# Altium project UVSD_HABalloon_OBC.PrjPcb
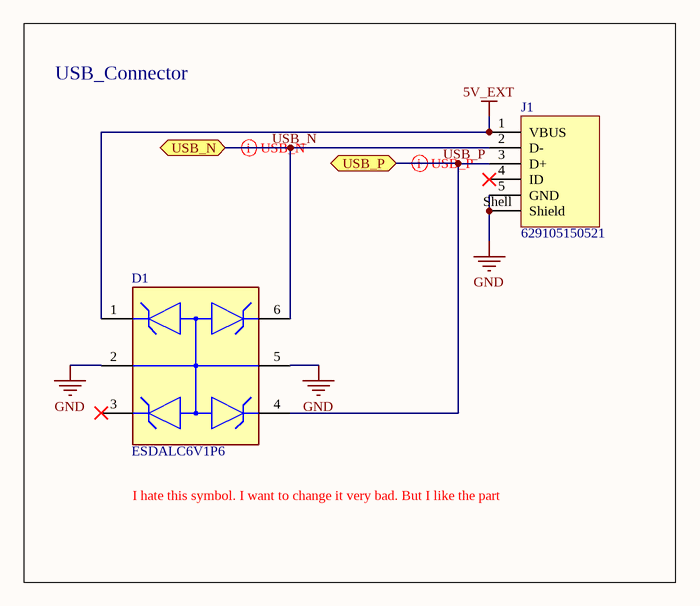
[diagram p0: IO.SchDoc]
3 sheets, 22 parts. Net scope: flat (ports and power ports of the same name join across sheets).
Sheets:
  Main.SchDoc
  IO.SchDoc
  Power.SchDoc

## Sheet Main.SchDoc
size A4; SheetNumber: 1; SheetTotal: 1

## Sheet IO.SchDoc: Input/Output
size A3; DrawnBy: Evan Peters; Revision: 1; SheetNumber: 3; SheetTotal: 4

### Parts
D1  ESDALC6V1P6  [FP-SOT-666IP-MFG]
J1  629105150521  [629105150521]

### Blocks framed on the sheet
USB_Connector: D1 J1

### Ports
USB_N (bidir, see Main[5B], MCU_STM32[2C]), USB_P (bidir, see Main[5B], MCU_STM32[2C])

### Nets
5V_EXT: D1.1 J1.1(VBUS)
GND: D1.2 D1.5 J1.5(GND) J1.Shell(Shield)
USB_N: D1.6 J1.2(D-) ; port USB_N
USB_P: D1.4 J1.3(D+) ; port USB_P

Not connected (* = marked no-connect by the designer): D1 3*; J1 4(ID)*

### Layout directives
differential pair: USB_N, USB_P

### Notes on the sheet
- I hate this symbol. I want to change it very bad. But I like the part

### Library data of the parts
D1 = CMP-12225-000016-1: TVS DIODE 3V SOT666IP; Manufacturer: STMicroelectronics; Peak Pulse Power: 30W; Capacitance: 7.5pF; Value: 7.5pF; Number Of Channels: 4; Description: 4 Channel 6.1V Uni-Directional Transil ESD Protection - SOT-666IP; Max Junction Temp: +150°C; Breakdown Voltage: 6.1V; Direction: Unidirectional; Device Class L1: Circuit Protection; Reverse Standoff Voltage: 3V; Package: SOT-666IP; Device Class L3: unset; Temperature Range Low: -40°C; ComponentLink2Description: Datasheet; Height: 0.62mm; ComponentLink2URL: https://www.st.com/resource/en/datasheet/esdalc6v1px.pdf; Category: Diode; RoHS: TRUE; Device Class L2: TVS Diodes; Mouser Description: ESDALC Series 4 Channel 6.1V Uni-Directional Transil? ESD Protection - SOT-666IP; Lead Free: Yes; Manufacturer Part Number: ESDALC6V1P6; Temperature Range High: +150°C; Temperature: -40°C to +150°C; Digikey Description: TVS DIODE 3V SOT666IP; Automotive: No; Octopart: https://octopart.com/esdalc6v1p6-stmicroelectronics-347727
J1 = CMP-1502-03252-3: NexarPartId: 52645113; Number of Contacts: 5; Contact Resistance: 30mΩ; Connector Type: USB; Voltage Rating: 30V; Current Rating: 3A; USB Standard: USB 2.0; Gender: Receptacle; Insulation Resistance: 1GΩ; Height: 2.86mm; REACH SVHC: Unknown; RoHS: Compliant; Features: Shielded; Termination: SMD/SMT; Number of Pins: 5; Contact Plating: Gold; Packaging: Tape and Reel; Contact Material: Gold; Mount: Horizontal, Surface Mount; Max Operating Temperature: 85°C; Lead Free: Lead Free; Min Operating Temperature: -40°C; Orientation: Horizontal; Operating Supply Voltage: 30V

## Sheet Power.SchDoc: Power Control
size A3; DrawnBy: Evan Peters; Revision: 1; SheetNumber: 4; SheetTotal: 4
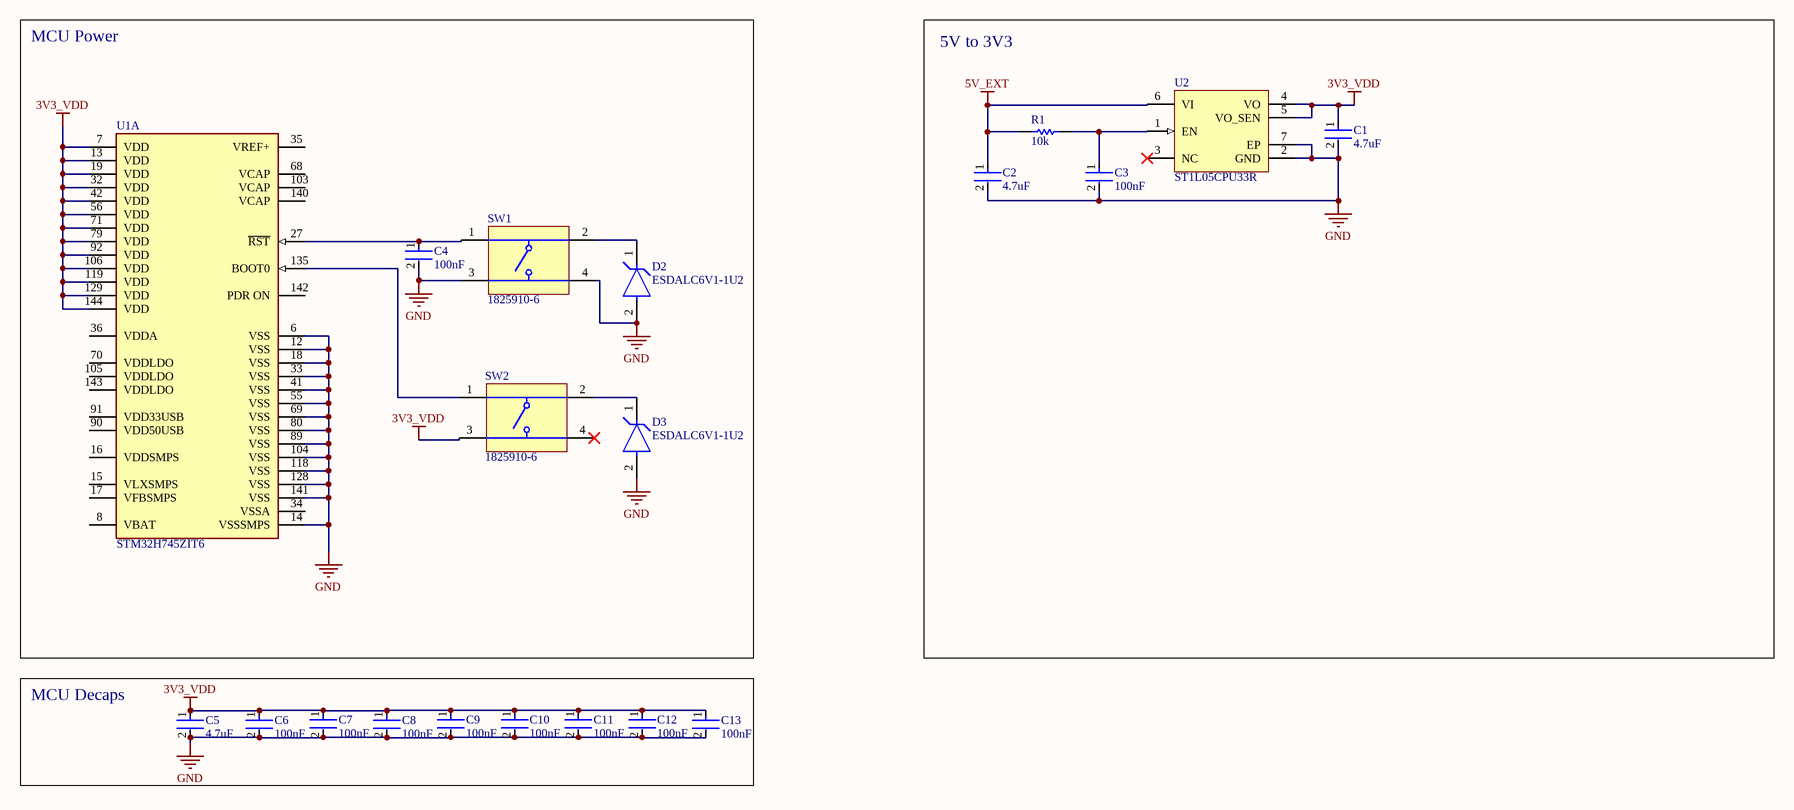
[diagram p1: Power.SchDoc]

### Parts
C1  4.7uF  [FP-C0603-CG-MFG]
C2  4.7uF  [FP-C0603-CG-MFG]
C3  100nF  [FP-CGA3E-0_3-0_1-IPC_A]
C4  100nF  [FP-CGA3E-0_3-0_1-IPC_A]
C5  4.7uF  [FP-C0603-CG-MFG]
C6  100nF  [FP-CGA3E-0_3-0_1-IPC_A]
C7  100nF  [FP-CGA3E-0_3-0_1-IPC_A]
C8  100nF  [FP-CGA3E-0_3-0_1-IPC_A]
C9  100nF  [FP-CGA3E-0_3-0_1-IPC_A]
C10  100nF  [FP-CGA3E-0_3-0_1-IPC_A]
C11  100nF  [FP-CGA3E-0_3-0_1-IPC_A]
C12  100nF  [FP-CGA3E-0_3-0_1-IPC_A]
C13  100nF  [FP-CGA3E-0_3-0_1-IPC_A]
D2  ESDALC6V1-1U2  [FP-ST0201-MFG]
D3  ESDALC6V1-1U2  [FP-ST0201-MFG]
R1  10k  [RESC1609X50X30NL8T20]
SW1  1825910-6  [TECO-1825910-6_V]
SW2  1825910-6  [TECO-1825910-6_V]
U1  STM32H745ZIT6  [FP-LQFP144-1A-MFG]  (part A of 3)
U2  ST1L05CPU33R  [DFN6D_N]

### Blocks framed on the sheet
MCU Power: C4 D2 D3 SW1 SW2 U1
5V to 3V3: C1-C3 R1 U2
MCU Decaps: C5-C13

### Nets
3V3_VDD: C1.1 C5.1 C6.1 C7.1 C8.1 C9.1 C10.1 C11.1 C12.1 C13.1 SW2.3 U1.7(VDD) U1.13(VDD) U1.19(VDD) U1.32(VDD) U1.42(VDD) U1.56(VDD) U1.71(VDD) U1.79(VDD) U1.92(VDD) U1.106(VDD) U1.119(VDD) U1.129(VDD) U1.144(VDD) U2.4(VO) U2.5(VO_SEN)
5V_EXT: C2.1 R1.1 U2.6(VI)
GND: C1.2 C2.2 C3.2 C4.2 C5.2 C6.2 C7.2 C8.2 C9.2 C10.2 C11.2 C12.2 C13.2 D2.2(A) D3.2(A) SW1.3 SW1.4 U1.6(VSS) U1.12(VSS) U1.14(VSSSMPS) U1.18(VSS) U1.33(VSS) U1.41(VSS) U1.55(VSS) U1.69(VSS) U1.80(VSS) U1.89(VSS) U1.104(VSS) U1.118(VSS) U1.128(VSS) U1.141(VSS) U2.2(GND) U2.7(EP)
NetC3_1: C3.1 R1.2 U2.1(EN)
NetC4_1: C4.1 SW1.1 U1.27(~{RST})
NetD2_1: D2.1(C) SW1.2
NetD3_1: D3.1(C) SW2.2
NetSW2_1: SW2.1 U1.135(BOOT0)

Not connected (* = marked no-connect by the designer): SW2 4*; U1 8(VBAT) 15(VLXSMPS) 16(VDDSMPS) 17(VFBSMPS) 34(VSSA) 35(VREF+) 36(VDDA) 68(VCAP) 70(VDDLDO) 90(VDD50USB) 91(VDD33USB) 103(VCAP) 105(VDDLDO) 140(VCAP) 142(PDR_ON) 143(VDDLDO); U2 3(NC)*

### Library data of the parts
C1 C2 C5 = CMP-2006-02256-2: CAP CER 4.7UF 6.3V X5R 0603; Manufacturer: Kemet; Manufacturer Part Number: C0603C475K9PACTU; Temperature Coefficient: 15%; Tolerance: 10%; Description: 4.7µF ±10% 6.3V Ceramic Capacitor X5R 0603 (1608 Metric); Material: Ceramic; Device Class L3: Ceramic Capacitors; RoHS: TRUE; Value: 4.7uF; Lead Free: Yes; ComponentLink2Description: Datasheet; Mouser Description: Multilayer Ceramic Capacitors MLCC - SMD/SMT 6.3volts 4.7uF X5R 10%; Package: C0603-CG; Digikey Description: CAP CER 4.7UF 6.3V X5R 0603; ComponentLink2URL: https://content.kemet.com/datasheets/KEM_C1006_X5R_SMD.pdf; Category: Cap; Temperature Range Low: -55°C; Capacitance: 4.7uF; Temperature: -55°C to +85°C; Octopart: https://octopart.com/c0603c475k9pactu-kemet-104242; Ipc Land Pattern Name: CAPC16080X80; Voltage Rating: 6.3V; Temperature Range High: +85°C; Height: 0.9mm; Temperature Characteristic: X5R; Device Class L1: Passive Components; Automotive: No; Device Class L2: Capacitors
C3 C4 C6-C13 = CMP-2000-07546-2: Cap Ceramic 100nF 50V X7R 10% Pad SMD 0603 +125°C Automotive T/R; Weight: 7.1E-05oz; Composition: Ceramic; Max Operating Temperature: 125°C; Termination: SMD/SMT; Dielectric: X7R; Length: 1.6mm; Package Quantity: 1; REACH SVHC: No SVHC; Lead Free: Lead Free; Case Code (Metric): 1608; Min Operating Temperature: -55°C; Packaging: Tape and Reel; Tolerance: 10%; Voltage Rating: 50V; Case Code (Imperial): 0603; Capacitance: 100nF; Case/Package: 0603; Voltage Rating (DC): 50V; Depth: 0.8mm; Radiation Hardening: No; Ratings: AEC-Q200; Mount: Surface Mount; Voltage: 50V; Thickness: 0.035inch; Width: 0.8mm; Height: 0.8mm
D2 D3 = CMP-12225-000007-1: TVS DIODE 3V ST0201; Manufacturer: STMicroelectronics; Number Of Channels: 1; Direction: Unidirectional; Max Junction Temp: +125°C; Breakdown Voltage: 6.1V; Capacitance: 12pF; Peak Pulse Current: 2A; Description: Clamp  Ipp Tvs Diode Surface Mount ST0201; Value: 12pF; Peak Pulse Power: 20W; Package: ST0201; Digikey Description: TVS DIODE 3V ST0201; Temperature Range High: +125°C; Octopart: https://octopart.com/esdalc6v1-1u2-stmicroelectronics-11912330; Category: Diode; Height: 0.33mm; RoHS: TRUE; ComponentLink2URL: https://www.st.com/content/ccc/resource/technical/document/datasheet/90/b1/aa/a3/9f/73/4d/1e/CD00212838.pdf/files/CD00212838.pdf/jcr:content/translations/en.CD00212838.pdf; Temperature Range Low: -40°C; Device Class L2: TVS Diodes; ComponentLink2Description: Datasheet; Manufacturer Part Number: ESDALC6V1-1U2; Device Class L1: Circuit Protection; Device Class L3: unset; Lead Free: Yes; Automotive: No; Mouser Description: TVS Diodes - Transient Voltage Suppressors Single-Line Low Cap ESD TVS 0201; Temperature: -40°C to +125°C
R1 = CMP-1666-00005-4: Chip Resistor, 10 KOhm, +/- 1%, 100 mW, -55 to 155 degC, 0603 (1608 Metric), RoHS, Tape and Reel; Manufacturer: Vishay Semiconductor; Voltage Rating: 75 V; Max Operating Temperature: 155 degC; PackageDescription: 2-Pin Surface Mount Device, Body 1.575 x 0.85 mm; ComponentLink1Description: Manufacturer URL; RoHSCompliant: true; PackageReference: 0603; REACH SVHC: Unknown; Length: 1.55 mm; DatasheetVersion: 06/2012; Packaging: Tape and Reel; Min Operating Temperature: -55 degC; Mounting Technology: Surface Mount; ComponentLink2URL: https://datasheet.ciiva.com/11809/0900766b80d98afc-11809037.pdf; Height: 0.45 mm; ComponentLink2Description: Datasheet; Package Quantity: 5000; ComponentLink1URL: http://www.vishay.com/
SW1 SW2 = CMP-1684-00021-1: Tact Switch, SPST-NO, 0.05 A, -35 to 85 degC, 4-Pin THD, RoHS, Bulk; Manufacturer: TE Connectivity; Maximum Contact Resistance: 100mOhm; Mechanical Life: 100000Cycles; Bushing Type: Unthreaded; Switch Configuration: OFF(ON); Maximum DC Voltage Rating: 24V; Contact Rating @ Voltage: 0.05A@24VDC; Actuator Color: Black; Body Orientation: Straight; Function: MomentaryContact; Illumination: N/R; Actuator Style: RoundButton; Actuator Material: PolybutyleneTerephthalate; Dielectric Strength: 500VAC; Pole Throw Configuration: SPST; Actuator Length: 1.4mm; Product Weight: N/A; Contact Material: CopperAlloy; Housing Material: N/A; Terminal Type: PCPins; Minimum Insulation Resistance: 100MOhm; Package Description: 4-Pin Through Hole Device, Body 5.99 x 5.99 mm, Pitch 6.5 mm; Part No: 1825910-6; Package Reference: THD; Base Material: N/A; Manufacturer URL: http://www.te.com; Contact Plating: Silver; RoHS: Yes; Datasheet Version: Rev. C9; Electrical Life: 100000Cycles; Maximum AC Voltage Rating: N/A; Thread Size: N/R; Operating Temperature: -35to85C; Mounting: ThroughHole; Dimension: 5.99x5mm; Datasheet URL: http://www.te.com/commerce/DocumentDelivery/DDEController?Action=showdoc&DocId=Customer+Drawing%7F1825910%7FC9%7Fpdf%7FEnglish%7FENG_CD_1825910_C9.pdf%7F1825910-6; Family: 1825910; Seal Location: N/A; Seal Description: N/A; Packaging: N/A
U1 = CMP-12105-000054-1: HIGH-PERFORMANCE AND DSP WITH DP; Manufacturer: STMicroelectronics; Number Of Timers/Counters: 20; Min Supply Voltage: 1.62V; Frequency: 480MHz; Number Of I2C Channels: 4; Memory Type: FLASH; Number Of I/Os: 97; Number Of Pwm Channels: 42; Number Of Usb Channels: 2; Ram Size: 1MBytes; Memory Size: 2MBytes; Data Bus Width: 32bits; Number Of Adc Channels: 23; Number Of Ethernet Channels: 1; Number Of Uart Channels: 9; Interface: I2C,SPI,UART,USART,CAN,USB,LIN,IrDA,Ethernet,I2S,Other; Number Of A/D Converters: 3; Max Junction Temp: +125°C; Max Supply Voltage: 3.6V; Description: ARM® Cortex®-M4, Cortex®-M7 STM32H7 Microcontroller IC 32-Bit Dual-Core 240MHz, 480MHz 2MB (2M x 8) FLASH 144-LQFP (20x20); Core Architecture: ARM Cortex-M4, Cortex-M7; Number Of Spi Channels: 6; Standoff Height: 0.05mm; Ambient Temperature Range Low: -40°C; Lead Free: Yes; Manufacturer Part Number: STM32H745ZIT6; Automotive: No; Height: 1.6mm; Device Class L1: Integrated Circuits (ICs); Ambient Temperature Range High: +85°C; RoHS: TRUE; Temperature Range High: +125°C; Temperature: -40°C to +125°C; Category: IC; Device Class L2: Embedded Processors and Controllers; Number Of Cores: 2; Temperature Range Low: -40°C; Octopart: https://octopart.com/stm32h745zit6-stmicroelectronics-100293939; Digikey Description: HIGH-PERFORMANCE AND DSP WITH DP; Package: LQFP144-1A; Device Class L3: Microcontrollers; ComponentLink2URL: https://www.st.com/resource/en/datasheet/stm32h745zi.pdf; ComponentLink2Description: Datasheet
U2 = CMP-0244-00293-1: Very Low Quiescent BiCMOS Voltage Regulator, 3.3V, 6-Pin VFDFPN, Tape and Reel; ComponentLink2Description: Datasheet; ComponentLink1Description: Manufacturer URL; ComponentLink2URL: http://www.st.com/internet/com/TECHNICAL_RESOURCES/TECHNICAL_LITERATURE/DATASHEET/CD00186925.pdf; PackageVersion: 2008; PackageReference: DFN6D; PackageDescription: 6-Pin Plastic, Dual LLP, 3 x 3 mm Body, 0.95 mm Pitch, Exposed Pad; DatasheetVersion: 1/09/2009; ComponentLink1URL: http://www.st.com

## Nets that join several sheets
5V_EXT: IO (D1.1 J1.1), Power (C2.1 R1.1 U2.6)
GND: IO (D1.2 D1.5 J1.5 J1.Shell), Power (33 pins)